# EAGLE schematic NOVASTACK Adapter V0.2 (EAGLE 9.5.1)
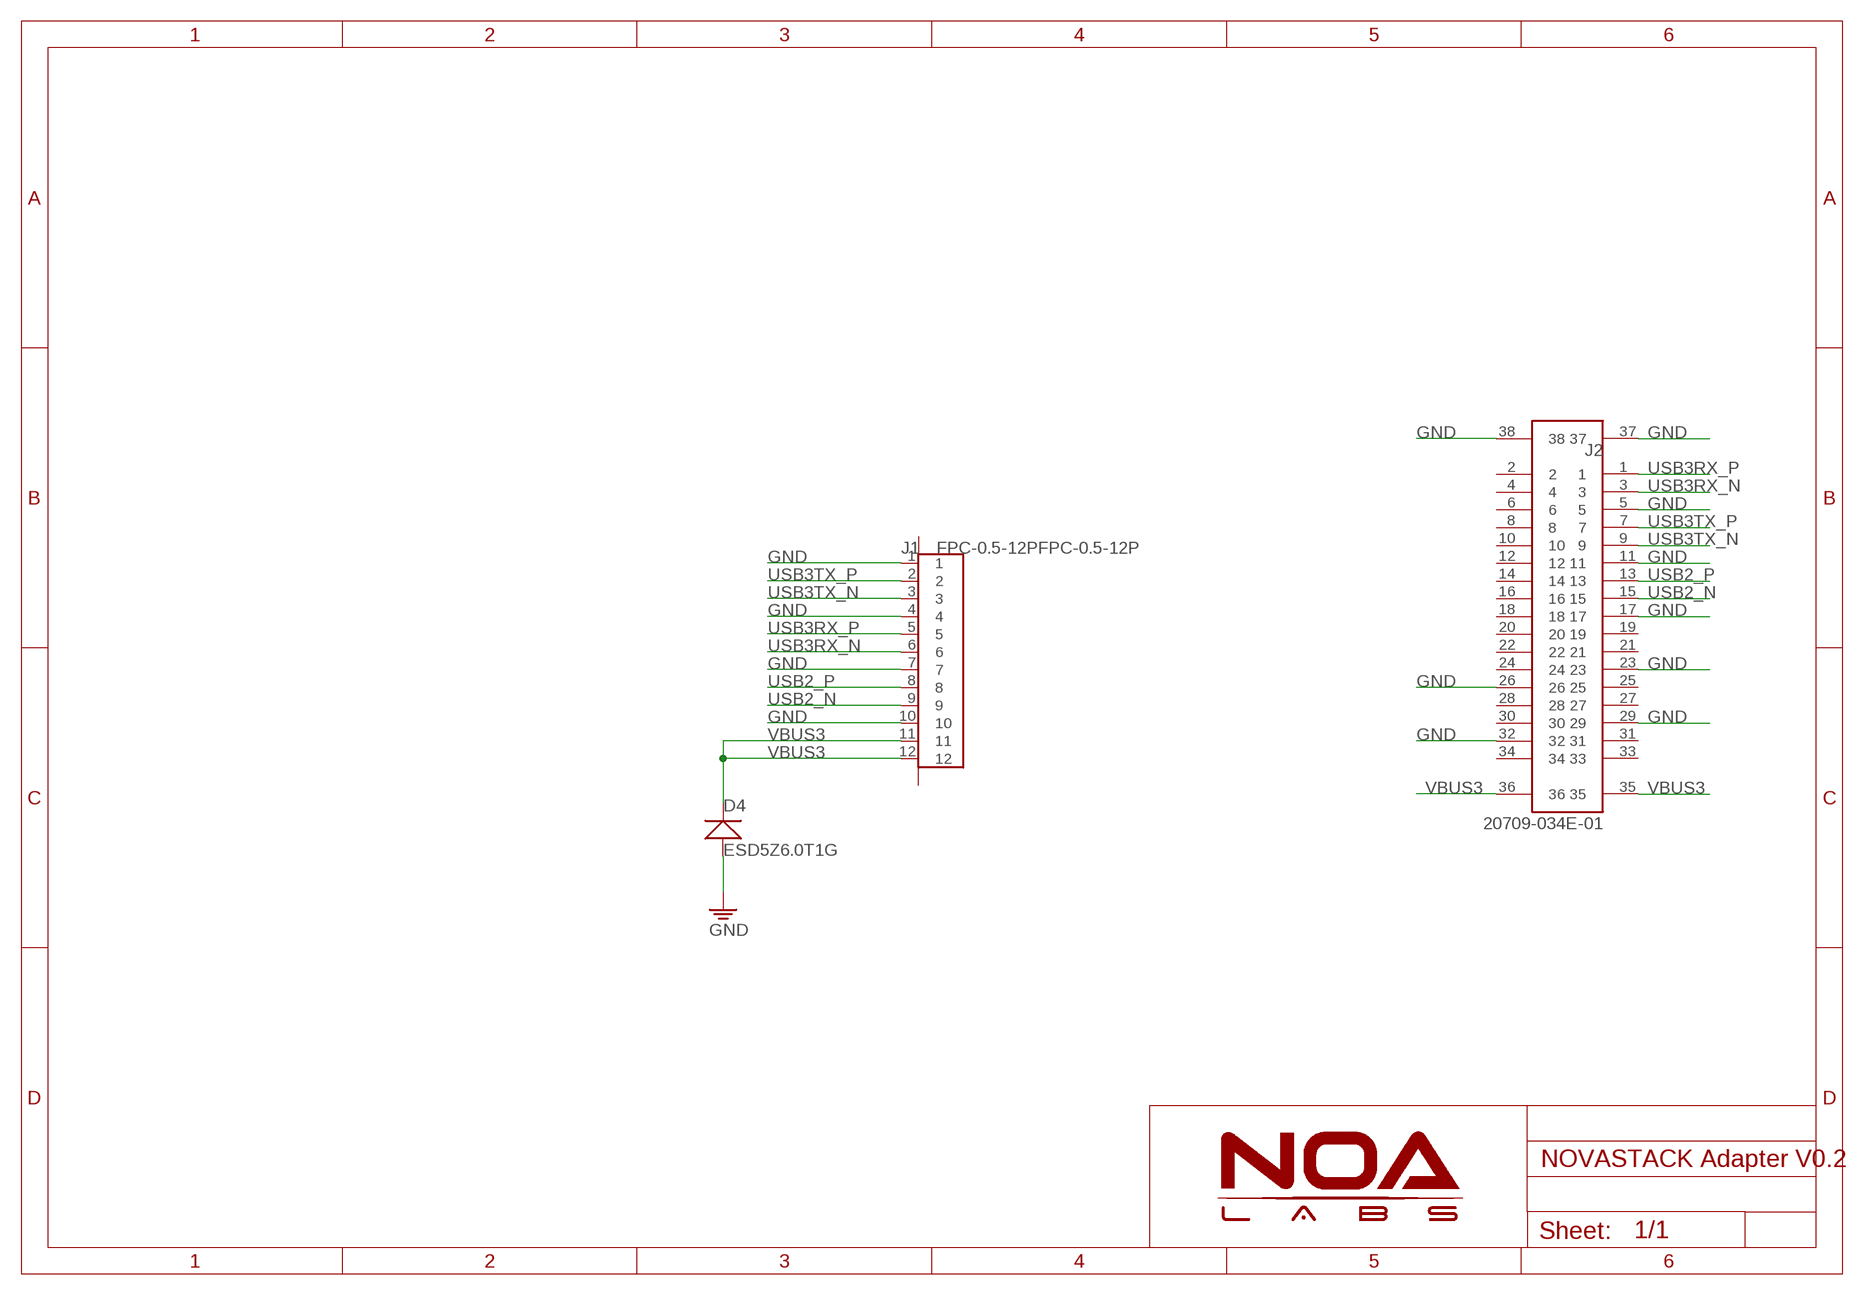
[diagram p0: schematic, sheet 1]

## Parts
D4  ESD5Z6.0T1G  D-0603  [SOD523]
J1  FPC-0.5-12PFPC-0.5-12P  [FPC-0.5-12P]
J2  20709-034E-01  [IPEX_20709-034E-01]

## Nets
GND: D4.+ J1.1 J1.4 J1.7 J1.10 J2.5 J2.11 J2.17 J2.23 J2.26 J2.29 J2.32 J2.37 J2.38
USB2_N: J1.9 J2.15
USB2_P: J1.8 J2.13
USB3RX_N: J1.6 J2.3
USB3RX_P: J1.5 J2.1
USB3TX_N: J1.3 J2.9
USB3TX_P: J1.2 J2.7
VBUS3: D4.- J1.11 J1.12 J2.35 J2.36
Unconnected: J1.P$13(G1) J1.P$14(G2) J2.2 J2.4 J2.6 J2.8 J2.10 J2.12 J2.14 J2.16 J2.18 J2.19 J2.20 J2.21 J2.22 J2.24 J2.25 J2.27 J2.28 J2.30 J2.31 J2.33 J2.34

## Library data of the parts
D4 = Discrete_NOA:D*
J1 = Connector_NOA:FPC-0.5-12P
J2 = Connector_NOA:20709-034E-01: Novastack 35-P Receptacle Assy; AVAILABILITY: Unavailable; DESCRIPTION: 0.35 mm pitch, 0.7 mm height, 2.3 mm depth, robust type with power pin; MF: I-PEX; MP: 20709-034E-01; PACKAGE: None; PRICE: None

## Net classes
1 Diff: width 0.282 mm, drill 0.2 mm, clearance 0.508 mm to class 0, clearance 0.102 mm